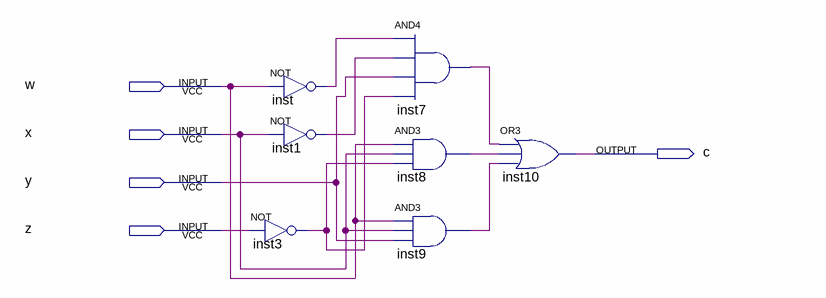
[diagram p0: schematic sheet]
// Quartus schematic C.bdf as structural Verilog: 7 symbols, 5 pins
module C (
  input  w,
  input  x,
  input  y,
  input  z,
  output c
);

  wire inst1_out, inst3_out, inst7_out, inst8_out, inst9_out, inst_out;

  not inst (inst_out, w);
  not inst1 (inst1_out, x);
  not inst3 (inst3_out, z);
  and inst7 (inst7_out, inst_out, inst1_out, y, inst3_out);
  and inst8 (inst8_out, w, x, inst3_out);
  and inst9 (inst9_out, w, x, y);
  or inst10 (c, inst7_out, inst8_out, inst9_out);
endmodule
